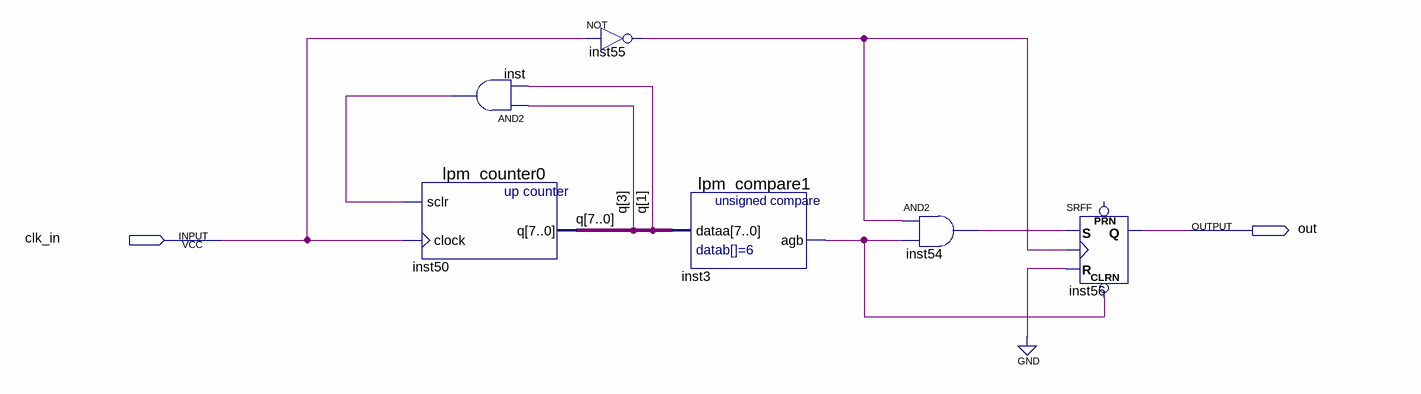
[diagram p0: schematic sheet]
// Quartus schematic Block2.bdf as structural Verilog: 6 symbols, 2 pins
module Block2 (
  input  clk_in,
  output out
);

  wire inst3_agb, inst54_out, inst55_out, inst_out;
  wire [7:0] q;

  lpm_counter0 inst50 (.sclr(inst_out), .clock(clk_in), .q(q));
  and inst (inst_out, q[3], q[1]);
  not inst55 (inst55_out, clk_in);
  lpm_compare1 inst3 (.dataa(q), .agb(inst3_agb));
  and inst54 (inst54_out, inst55_out, inst3_agb);
  SRFF inst56 (.CLRN(inst3_agb), .S(inst54_out), .R(1'b0), .CLK(inst55_out), .Q(out));  // open: PRN
endmodule
